# Altium project FMC_Power_Module.PrjPcb
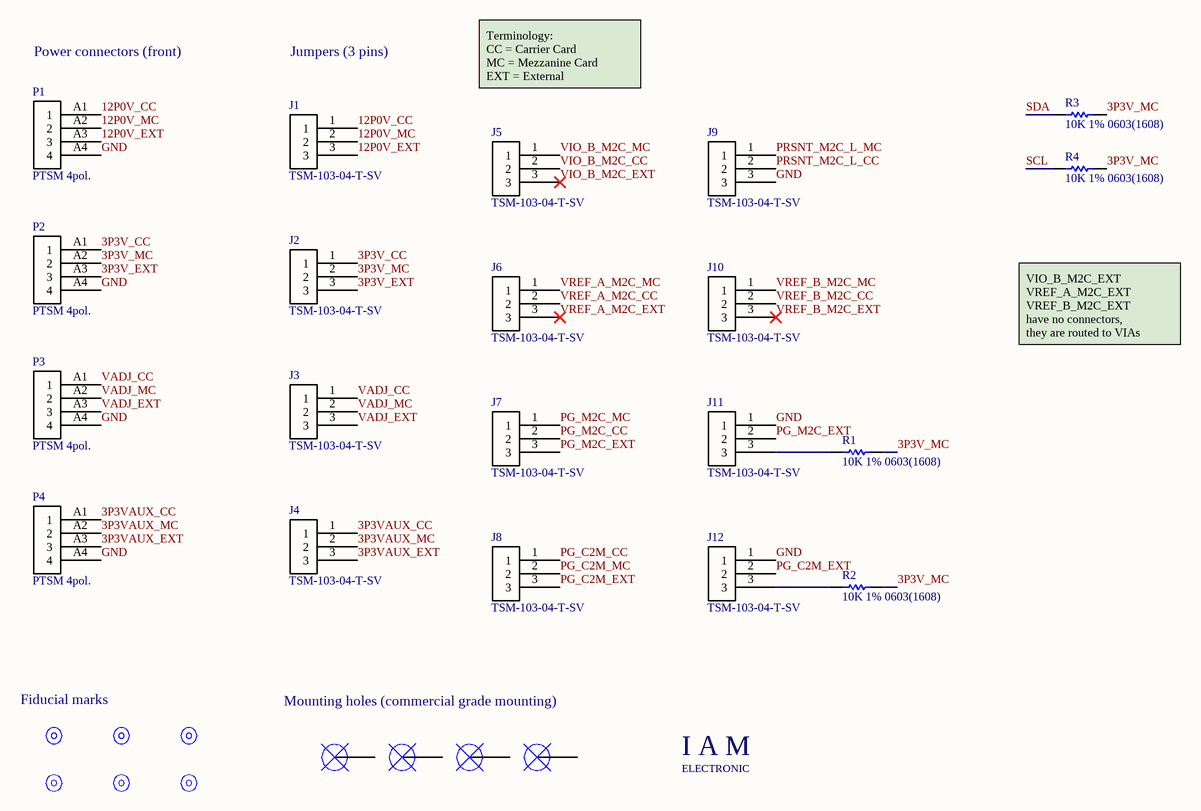
[diagram p0: FMC_Power_Module.SchDoc]
6 sheets, 33 parts. Net scope: global (net labels, ports and power ports of the same name join across sheets).
Board file: FMC_Power_Module.PcbDoc
Sheets:
  FMC_Power_Module.SchDoc
  HPC_AB.SchDoc
  HPC_CD.SchDoc
  HPC_EF.SchDoc
  HPC_GH.SchDoc
  HPC_IJ.SchDoc

## Sheet FMC_Power_Module.SchDoc: Front panel connectors, Jumpers, Mounting holes, and Fiducials
size A4; Date: 20.05.2022; ApprovedBy: PFH; CompanyName: IAM Electronic GmbH; DrawnBy: PFH; Engineer: PFH; Revision: A; SheetNumber: 1; SheetTotal: 6; Projekt: FMC Power Module; Website: www.fmchub.com

### Parts
FM1  1mm  [FIDUCIAL_MARK_ROUND_RING]  (value not drawn)  (no BOM)
FM2  1mm  [FIDUCIAL_MARK_ROUND_RING]  (value not drawn)  (no BOM)
FM3  1mm  [FIDUCIAL_MARK_ROUND_RING]  (value not drawn)  (no BOM)
FM4  1mm  [FIDUCIAL_MARK_ROUND_RING]  (value not drawn)  (no BOM)
FM5  1mm  [FIDUCIAL_MARK_ROUND_RING]  (value not drawn)  (no BOM)
FM6  1mm  [FIDUCIAL_MARK_ROUND_RING]  (value not drawn)  (no BOM)
J1  TSM-103-04-T-SV  [TSM-103-04-T-SV]
J2  TSM-103-04-T-SV  [TSM-103-04-T-SV]
J3  TSM-103-04-T-SV  [TSM-103-04-T-SV]
J4  TSM-103-04-T-SV  [TSM-103-04-T-SV]
J5  TSM-103-04-T-SV  [TSM-103-04-T-SV]
J6  TSM-103-04-T-SV  [TSM-103-04-T-SV]
J7  TSM-103-04-T-SV  [TSM-103-04-T-SV]
J8  TSM-103-04-T-SV  [TSM-103-04-T-SV]
J9  TSM-103-04-T-SV  [TSM-103-04-T-SV]
J10  TSM-103-04-T-SV  [TSM-103-04-T-SV]
J11  TSM-103-04-T-SV  [TSM-103-04-T-SV]
J12  TSM-103-04-T-SV  [TSM-103-04-T-SV]
MH1  2.2mm  [Mounting_Hole_2.2mm]  (value not drawn)  (no BOM)
MH2  2.2mm  [Mounting_Hole_2.2mm]  (value not drawn)  (no BOM)
MH3  2.7mm  [Mounting_Hole_Plated_2.7mm-COVERED]  (value not drawn)  (no BOM)
MH4  2.7mm  [Mounting_Hole_Plated_2.7mm-COVERED]  (value not drawn)  (no BOM)
P1  PTSM 4pol.  [PTSM-4pol]
P2  PTSM 4pol.  [PTSM-4pol]
P3  PTSM 4pol.  [PTSM-4pol]
P4  PTSM 4pol.  [PTSM-4pol]
R1  10K 1% 0603(1608)  [RESC0603(1608)_N]
R2  10K 1% 0603(1608)  [RESC0603(1608)_N]
R3  10K 1% 0603(1608)  [RESC0603(1608)_N]
R4  10K 1% 0603(1608)  [RESC0603(1608)_N]
STR1  IAM LOGO  [IAM LOGO - LARGE - WWW]  (value not drawn)  (no BOM)

### Nets
3P3V_CC: J2.1 P2.A1(1)
3P3V_EXT: J2.3 P2.A3(3)
3P3V_MC: J2.2 P2.A2(2) R1.2 R2.2 R3.2 R4.2
3P3VAUX_CC: J4.1 P4.A1(1)
3P3VAUX_EXT: J4.3 P4.A3(3)
3P3VAUX_MC: J4.2 P4.A2(2)
12P0V_CC: J1.1 P1.A1(1)
12P0V_EXT: J1.3 P1.A3(3)
12P0V_MC: J1.2 P1.A2(2)
GND: J9.3 J11.1 J12.1 P1.A4(4) P2.A4(4) P3.A4(4) P4.A4(4)
PG_C2M_CC: J8.1
PG_C2M_EXT: J8.3 J12.2
PG_C2M_MC: J8.2
PG_M2C_CC: J7.2
PG_M2C_EXT: J7.3 J11.2
PG_M2C_MC: J7.1
PRSNT_M2C_L_CC: J9.2
PRSNT_M2C_L_MC: J9.1
SCL: R4.1
SDA: R3.1
VADJ_CC: J3.1 P3.A1(1)
VADJ_EXT: J3.3 P3.A3(3)
VADJ_MC: J3.2 P3.A2(2)
VIO_B_M2C_CC: J5.2
VIO_B_M2C_EXT: J5.3
VIO_B_M2C_MC: J5.1
VREF_A_M2C_CC: J6.2
VREF_A_M2C_EXT: J6.3
VREF_A_M2C_MC: J6.1
VREF_B_M2C_CC: J10.2
VREF_B_M2C_EXT: J10.3
VREF_B_M2C_MC: J10.1
NetJ11_3: J11.3 R1.1
NetJ12_3: J12.3 R2.1

Not connected (* = marked no-connect by the designer): FM1 FD0; FM2 FD0; FM3 FD0; FM4 FD0; FM5 FD0; FM6 FD0; MH1 0; MH2 0; MH3 0; MH4 0

### Notes on the sheet
- Power connectors (front)
- Jumpers (3 pins)
- Terminology:
  CC = Carrier Card
  MC = Mezzanine Card
  EXT = External
- VIO_B_M2C_EXT
  VREF_A_M2C_EXT
  VREF_B_M2C_EXT
  have no connectors,
  they are routed to VIAs
- Fiducial marks
- Mounting holes (commercial grade mounting)
- Title:
- Project:
- Date:
- Website:
- Rev:
- Engineer:
- Sheet:
- /
- (in symbol IAM_LOGO) I A M; ELECTRONIC

### Library data of the parts
FM1-FM6 = Fiducial_Mark: Fiducial mark, width 1mm, clearance 3mm; Width: 1 mm; Clearance: 3 mm
J1-J12 = TSM-103-04-T-SV: .100" (2.54 mm) pitch 3 pin header, 0.27" (6.86 mm) total height, SMT; Manufacturer: Samtec; Part: TSM-103-04-T-SV
MH1 MH2 = Mounting_Hole_2.2mm: Mounting hole, hole size 2.2mm; Hole radius: 2.2 mm; Diameter (plated): *; Keep out (radius): *; Plated: *
MH3 MH4 = Mounting_Hole_2.7mm: Mounting hole, hole size 2.7mm; Hole radius: 2.7 mm; Diameter (plated): *; Keep out (radius): *; Plated: *
P1-P4 = PC-PTSM-4pol: Phoenix Contact PTSM SMT connector; Part: 1814650; Manufacturer: Phoenix Contact
R1-R4 = CMP-1012-00623-1: 10K 0603 (1608 Metric)  SMD; Part: WR06X1002FTL; Manufacturer: Walsin; Power: 0.1 W; Value: 10000.00 Ohm; Case-EIA: 0603; Case-Metric: 1608; Tolerance: 1 %; Technology: SMT
STR1 = IAM_LOGO: I A M E L E C T R O N I C - Logo; Layer: Top Overlay; Manufacturer: IAM ELECTRONIC; Part: Logo

## Sheet HPC_AB.SchDoc: HPC connector ROW A and ROW B
size A4; Date: 20.05.2022; ApprovedBy: PFH; CompanyName: IAM Electronic GmbH; DrawnBy: PFH; Engineer: PFH; Revision: A; SheetNumber: 2; SheetTotal: 6; Projekt: FMC Power Module; Website: www.iamelectronic.com
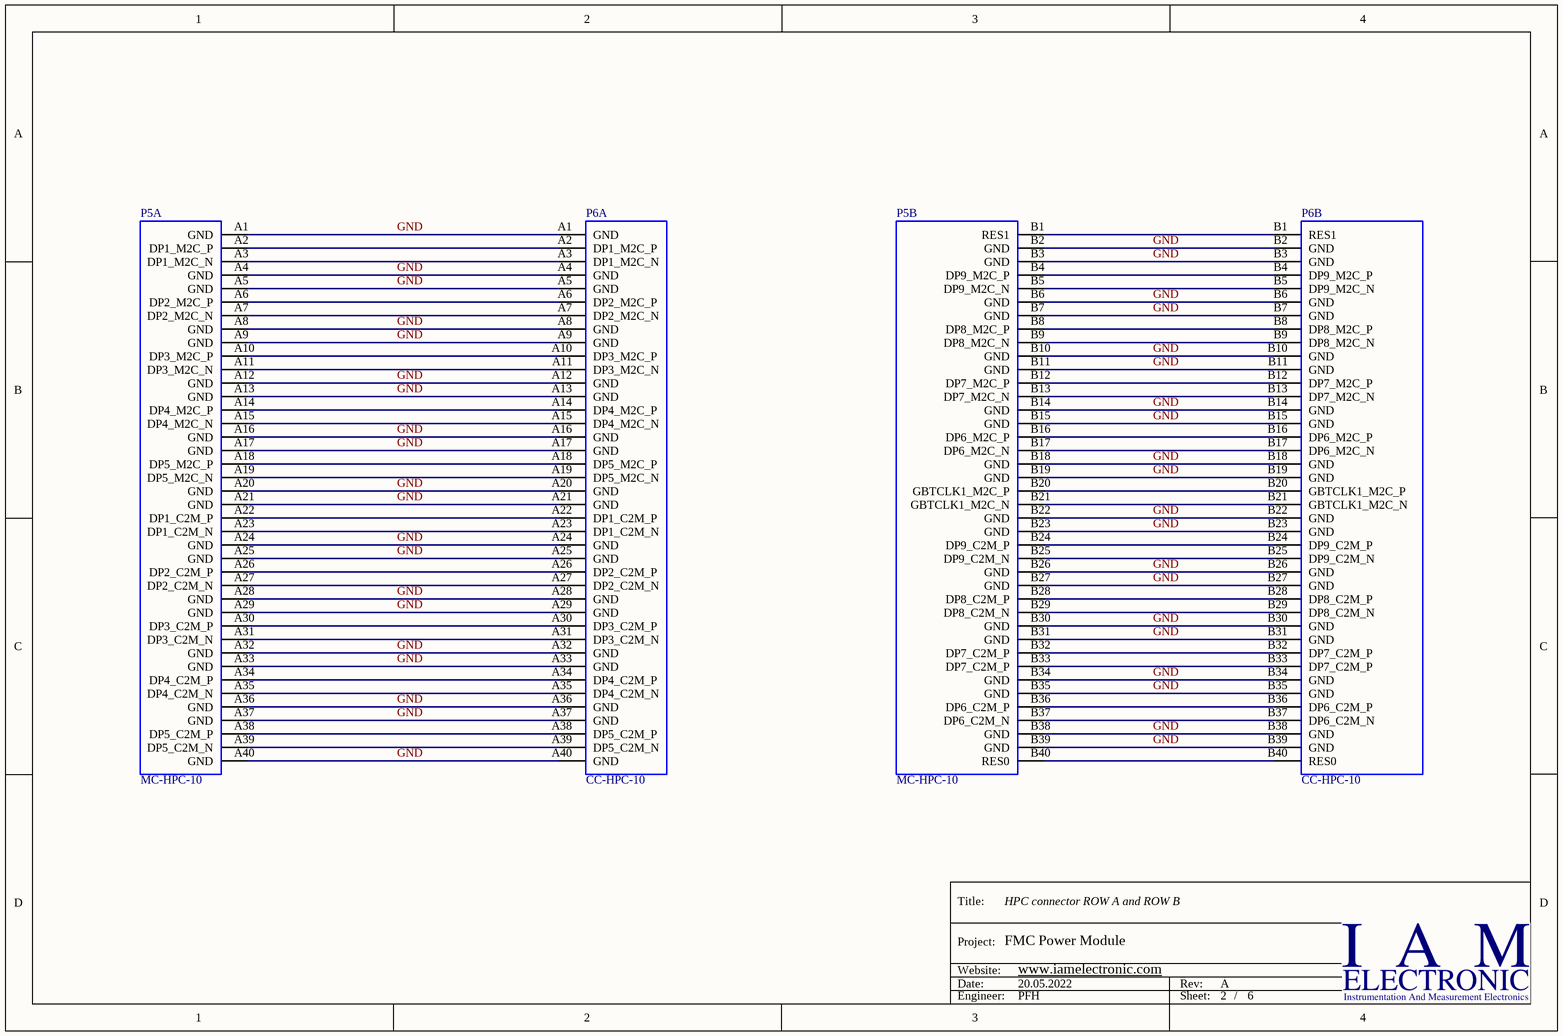
[diagram p1: HPC_AB.SchDoc]

### Parts
P5  MC-HPC-10  [ASP-134488-01]  (parts A,B of 10)
P6  CC-HPC-10  [ASP-134486-01]  (parts A,B of 10)

### Nets
GND: P5.A1(GND) P5.A4(GND) P5.A5(GND) P5.A8(GND) P5.A9(GND) P5.A12(GND) P5.A13(GND) P5.A16(GND) P5.A17(GND) P5.A20(GND) P5.A21(GND) P5.A24(GND) P5.A25(GND) P5.A28(GND) P5.A29(GND) P5.A32(GND) P5.A33(GND) P5.A36(GND) P5.A37(GND) P5.A40(GND) P5.B2(GND) P5.B3(GND) P5.B6(GND) P5.B7(GND) P5.B10(GND) P5.B11(GND) P5.B14(GND) P5.B15(GND) P5.B18(GND) P5.B19(GND) P5.B22(GND) P5.B23(GND) P5.B26(GND) P5.B27(GND) P5.B30(GND) P5.B31(GND) P5.B34(GND) P5.B35(GND) P5.B38(GND) P5.B39(GND) P6.A1(GND) P6.A4(GND) P6.A5(GND) P6.A8(GND) P6.A9(GND) P6.A12(GND) P6.A13(GND) P6.A16(GND) P6.A17(GND) P6.A20(GND) P6.A21(GND) P6.A24(GND) P6.A25(GND) P6.A28(GND) P6.A29(GND) P6.A32(GND) P6.A33(GND) P6.A36(GND) P6.A37(GND) P6.A40(GND) P6.B2(GND) P6.B3(GND) P6.B6(GND) P6.B7(GND) P6.B10(GND) P6.B11(GND) P6.B14(GND) P6.B15(GND) P6.B18(GND) P6.B19(GND) P6.B22(GND) P6.B23(GND) P6.B26(GND) P6.B27(GND) P6.B30(GND) P6.B31(GND) P6.B34(GND) P6.B35(GND) P6.B38(GND) P6.B39(GND)
NetP5_A2: P5.A2(DP1_M2C_P) P6.A2(DP1_M2C_P)
NetP5_A3: P5.A3(DP1_M2C_N) P6.A3(DP1_M2C_N)
NetP5_A6: P5.A6(DP2_M2C_P) P6.A6(DP2_M2C_P)
NetP5_A7: P5.A7(DP2_M2C_N) P6.A7(DP2_M2C_N)
NetP5_A10: P5.A10(DP3_M2C_P) P6.A10(DP3_M2C_P)
NetP5_A11: P5.A11(DP3_M2C_N) P6.A11(DP3_M2C_N)
NetP5_A14: P5.A14(DP4_M2C_P) P6.A14(DP4_M2C_P)
NetP5_A15: P5.A15(DP4_M2C_N) P6.A15(DP4_M2C_N)
NetP5_A18: P5.A18(DP5_M2C_P) P6.A18(DP5_M2C_P)
NetP5_A19: P5.A19(DP5_M2C_N) P6.A19(DP5_M2C_N)
NetP5_A22: P5.A22(DP1_C2M_P) P6.A22(DP1_C2M_P)
NetP5_A23: P5.A23(DP1_C2M_N) P6.A23(DP1_C2M_N)
NetP5_A26: P5.A26(DP2_C2M_P) P6.A26(DP2_C2M_P)
NetP5_A27: P5.A27(DP2_C2M_N) P6.A27(DP2_C2M_N)
NetP5_A30: P5.A30(DP3_C2M_P) P6.A30(DP3_C2M_P)
NetP5_A31: P5.A31(DP3_C2M_N) P6.A31(DP3_C2M_N)
NetP5_A34: P5.A34(DP4_C2M_P) P6.A34(DP4_C2M_P)
NetP5_A35: P5.A35(DP4_C2M_N) P6.A35(DP4_C2M_N)
NetP5_A38: P5.A38(DP5_C2M_P) P6.A38(DP5_C2M_P)
NetP5_A39: P5.A39(DP5_C2M_N) P6.A39(DP5_C2M_N)
NetP5_B1: P5.B1(RES1) P6.B1(RES1)
NetP5_B4: P5.B4(DP9_M2C_P) P6.B4(DP9_M2C_P)
NetP5_B5: P5.B5(DP9_M2C_N) P6.B5(DP9_M2C_N)
NetP5_B8: P5.B8(DP8_M2C_P) P6.B8(DP8_M2C_P)
NetP5_B9: P5.B9(DP8_M2C_N) P6.B9(DP8_M2C_N)
NetP5_B12: P5.B12(DP7_M2C_P) P6.B12(DP7_M2C_P)
NetP5_B13: P5.B13(DP7_M2C_N) P6.B13(DP7_M2C_N)
NetP5_B16: P5.B16(DP6_M2C_P) P6.B16(DP6_M2C_P)
NetP5_B17: P5.B17(DP6_M2C_N) P6.B17(DP6_M2C_N)
NetP5_B20: P5.B20(GBTCLK1_M2C_P) P6.B20(GBTCLK1_M2C_P)
NetP5_B21: P5.B21(GBTCLK1_M2C_N) P6.B21(GBTCLK1_M2C_N)
NetP5_B24: P5.B24(DP9_C2M_P) P6.B24(DP9_C2M_P)
NetP5_B25: P5.B25(DP9_C2M_N) P6.B25(DP9_C2M_N)
NetP5_B28: P5.B28(DP8_C2M_P) P6.B28(DP8_C2M_P)
NetP5_B29: P5.B29(DP8_C2M_N) P6.B29(DP8_C2M_N)
NetP5_B32: P5.B32(DP7_C2M_P) P6.B32(DP7_C2M_P)
NetP5_B33: P5.B33(DP7_C2M_P) P6.B33(DP7_C2M_P)
NetP5_B36: P5.B36(DP6_C2M_P) P6.B36(DP6_C2M_P)
NetP5_B37: P5.B37(DP6_C2M_N) P6.B37(DP6_C2M_N)
NetP5_B40: P5.B40(RES0) P6.B40(RES0)

### Notes on the sheet
- Title:
- Project:
- Date:
- Website:
- Rev:
- Engineer:
- Sheet:
- /

### Library data of the parts
P5 = MC-HPC-10: MC-HPC-10, FMC High-pin count connector, lead free, 400 I/Os, male, 10 mm mated stack height; Manufacturer: Samtec; Manufacturer Ref: SEAM-40-03.5-S-10-2-A-K-TR-VITA57.0; Pitch: 1.27 mm; Mated Stack Height: 10 mm; Solder Type: Lead-Free; Number I/O: 400; PartName: ASP-134488-01; Part: ASP-134488-01; Vita PartNumber: MC-HPC-10; Pin Count: High; Gender: male; Supplier 1: Digi-Key; Supplier Part Number 1: SAM8730-ND
P6 = CC-HPC-10: CC-HPC-10, FMC High-pin count connector, lead free, 400 I/Os, female, 10 mm mated stack height; Manufacturer: Samtec; Manufacturer Ref: SEAF-40-06.5-10-A; Pitch: 1.27 mm; Mated Stack Height: 10 mm; Solder Type: Lead-Free; Number I/O: 400; PartName: ASP-134486-01; Part: ASP-134486-01; Vita PartNumber: CC-HPC-10; Pin Count: High; Gender: female; Supplier 1: Digi-Key; Supplier Part Number 1: SAM8728-ND

## Sheet HPC_CD.SchDoc: HPC connector ROW C and ROW D
size A4; Date: 20.05.2022; ApprovedBy: PFH; CompanyName: IAM Electronic GmbH; DrawnBy: PFH; Engineer: PFH; Revision: A; SheetNumber: 3; SheetTotal: 6; Projekt: FMC Power Module; Website: www.iamelectronic.com
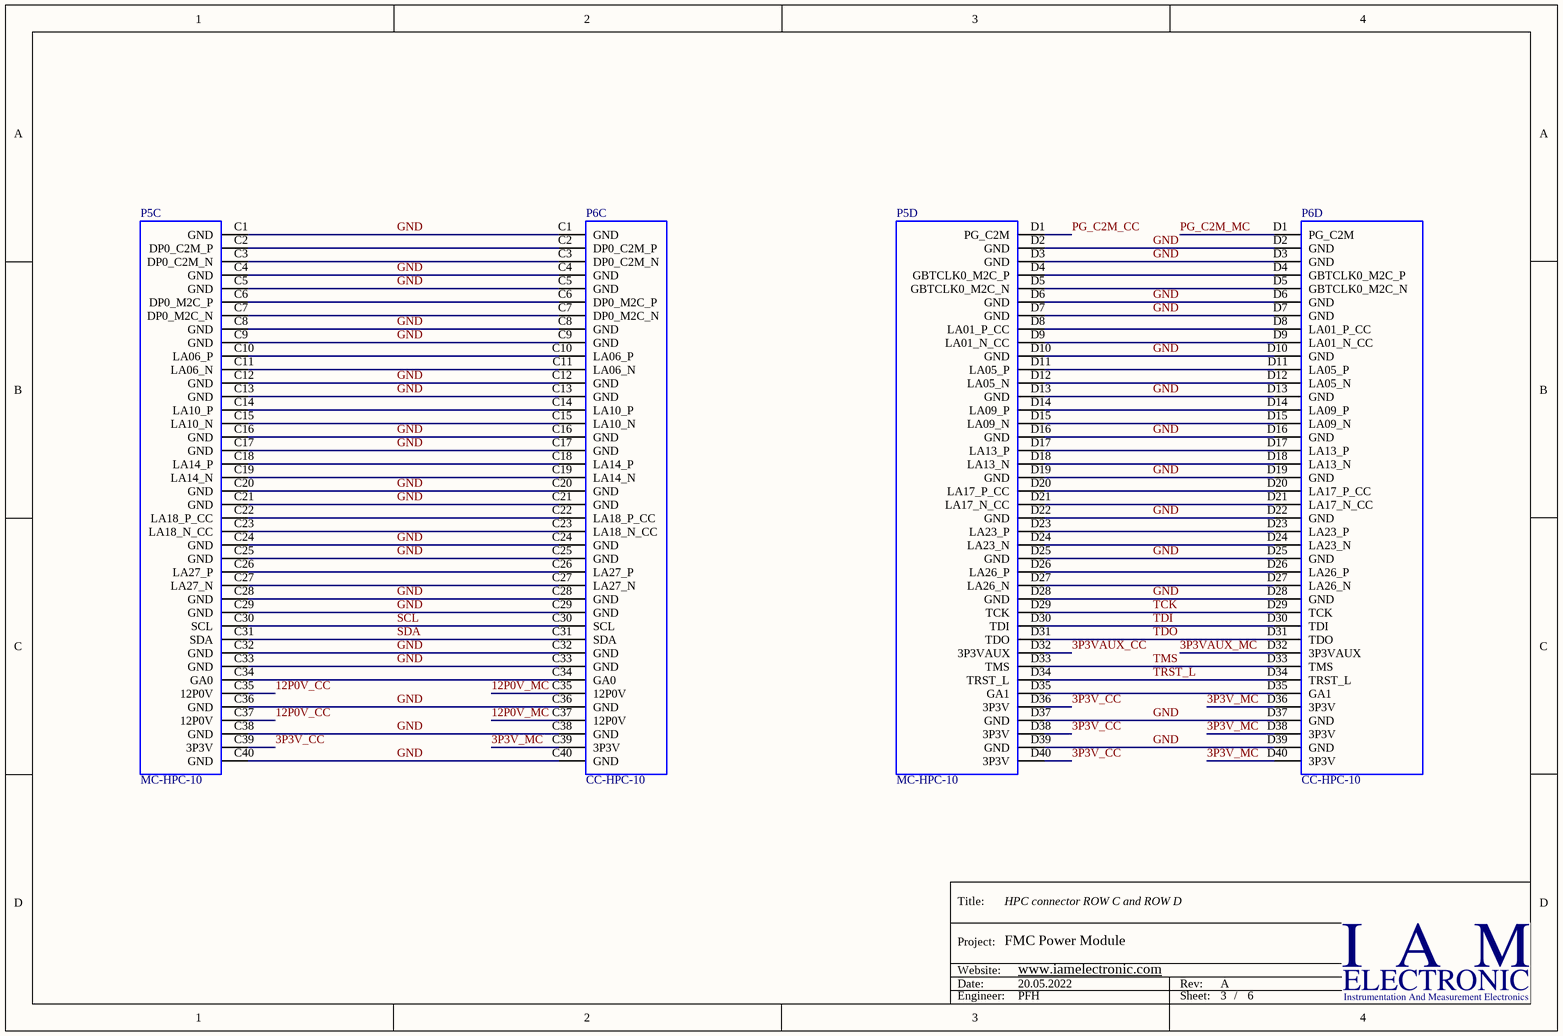
[diagram p2: HPC_CD.SchDoc]

### Parts
P5  MC-HPC-10  [ASP-134488-01]  (parts C,D of 10)
P6  CC-HPC-10  [ASP-134486-01]  (parts C,D of 10)

### Nets
3P3V_CC: P5.C39(3P3V) P5.D36(3P3V) P5.D38(3P3V) P5.D40(3P3V)
3P3V_MC: P6.C39(3P3V) P6.D36(3P3V) P6.D38(3P3V) P6.D40(3P3V)
3P3VAUX_CC: P5.D32(3P3VAUX)
3P3VAUX_MC: P6.D32(3P3VAUX)
12P0V_CC: P5.C35(12P0V) P5.C37(12P0V)
12P0V_MC: P6.C35(12P0V) P6.C37(12P0V)
GND: P5.C1(GND) P5.C4(GND) P5.C5(GND) P5.C8(GND) P5.C9(GND) P5.C12(GND) P5.C13(GND) P5.C16(GND) P5.C17(GND) P5.C20(GND) P5.C21(GND) P5.C24(GND) P5.C25(GND) P5.C28(GND) P5.C29(GND) P5.C32(GND) P5.C33(GND) P5.C36(GND) P5.C38(GND) P5.C40(GND) P5.D2(GND) P5.D3(GND) P5.D6(GND) P5.D7(GND) P5.D10(GND) P5.D13(GND) P5.D16(GND) P5.D19(GND) P5.D22(GND) P5.D25(GND) P5.D28(GND) P5.D37(GND) P5.D39(GND) P6.C1(GND) P6.C4(GND) P6.C5(GND) P6.C8(GND) P6.C9(GND) P6.C12(GND) P6.C13(GND) P6.C16(GND) P6.C17(GND) P6.C20(GND) P6.C21(GND) P6.C24(GND) P6.C25(GND) P6.C28(GND) P6.C29(GND) P6.C32(GND) P6.C33(GND) P6.C36(GND) P6.C38(GND) P6.C40(GND) P6.D2(GND) P6.D3(GND) P6.D6(GND) P6.D7(GND) P6.D10(GND) P6.D13(GND) P6.D16(GND) P6.D19(GND) P6.D22(GND) P6.D25(GND) P6.D28(GND) P6.D37(GND) P6.D39(GND)
PG_C2M_CC: P5.D1(PG_C2M)
PG_C2M_MC: P6.D1(PG_C2M)
SCL: P5.C30(SCL) P6.C30(SCL)
SDA: P5.C31(SDA) P6.C31(SDA)
TCK: P5.D29(TCK) P6.D29(TCK)
TDI: P5.D30(TDI) P6.D30(TDI)
TDO: P5.D31(TDO) P6.D31(TDO)
TMS: P5.D33(TMS) P6.D33(TMS)
TRST_L: P5.D34(TRST_L) P6.D34(TRST_L)
NetP5_C2: P5.C2(DP0_C2M_P) P6.C2(DP0_C2M_P)
NetP5_C3: P5.C3(DP0_C2M_N) P6.C3(DP0_C2M_N)
NetP5_C6: P5.C6(DP0_M2C_P) P6.C6(DP0_M2C_P)
NetP5_C7: P5.C7(DP0_M2C_N) P6.C7(DP0_M2C_N)
NetP5_C10: P5.C10(LA06_P) P6.C10(LA06_P)
NetP5_C11: P5.C11(LA06_N) P6.C11(LA06_N)
NetP5_C14: P5.C14(LA10_P) P6.C14(LA10_P)
NetP5_C15: P5.C15(LA10_N) P6.C15(LA10_N)
NetP5_C18: P5.C18(LA14_P) P6.C18(LA14_P)
NetP5_C19: P5.C19(LA14_N) P6.C19(LA14_N)
NetP5_C22: P5.C22(LA18_P_CC) P6.C22(LA18_P_CC)
NetP5_C23: P5.C23(LA18_N_CC) P6.C23(LA18_N_CC)
NetP5_C26: P5.C26(LA27_P) P6.C26(LA27_P)
NetP5_C27: P5.C27(LA27_N) P6.C27(LA27_N)
NetP5_C34: P5.C34(GA0) P6.C34(GA0)
NetP5_D4: P5.D4(GBTCLK0_M2C_P) P6.D4(GBTCLK0_M2C_P)
NetP5_D5: P5.D5(GBTCLK0_M2C_N) P6.D5(GBTCLK0_M2C_N)
NetP5_D8: P5.D8(LA01_P_CC) P6.D8(LA01_P_CC)
NetP5_D9: P5.D9(LA01_N_CC) P6.D9(LA01_N_CC)
NetP5_D11: P5.D11(LA05_P) P6.D11(LA05_P)
NetP5_D12: P5.D12(LA05_N) P6.D12(LA05_N)
NetP5_D14: P5.D14(LA09_P) P6.D14(LA09_P)
NetP5_D15: P5.D15(LA09_N) P6.D15(LA09_N)
NetP5_D17: P5.D17(LA13_P) P6.D17(LA13_P)
NetP5_D18: P5.D18(LA13_N) P6.D18(LA13_N)
NetP5_D20: P5.D20(LA17_P_CC) P6.D20(LA17_P_CC)
NetP5_D21: P5.D21(LA17_N_CC) P6.D21(LA17_N_CC)
NetP5_D23: P5.D23(LA23_P) P6.D23(LA23_P)
NetP5_D24: P5.D24(LA23_N) P6.D24(LA23_N)
NetP5_D26: P5.D26(LA26_P) P6.D26(LA26_P)
NetP5_D27: P5.D27(LA26_N) P6.D27(LA26_N)
NetP5_D35: P5.D35(GA1) P6.D35(GA1)

### Notes on the sheet
- Title:
- Project:
- Date:
- Website:
- Rev:
- Engineer:
- Sheet:
- /

### Library data of the parts
P5 = MC-HPC-10: as P5 on sheet HPC_AB; PartName: ASP-134488-01; Part: ASP-134488-01; Vita PartNumber: MC-HPC-10; Pin Count: High; Gender: male; Supplier 1: Digi-Key; Supplier Part Number 1: SAM8730-ND
P6 = CC-HPC-10: as P6 on sheet HPC_AB; PartName: ASP-134486-01; Part: ASP-134486-01; Vita PartNumber: CC-HPC-10; Pin Count: High; Gender: female; Supplier 1: Digi-Key; Supplier Part Number 1: SAM8728-ND

## Sheet HPC_EF.SchDoc: HPC connector ROW E and ROW F
size A4; Date: 20.05.2022; ApprovedBy: PFH; CompanyName: IAM Electronic GmbH; DrawnBy: PFH; Engineer: PFH; Revision: A; SheetNumber: 4; SheetTotal: 6; Projekt: FMC Power Module; Website: www.iamelectronic.com
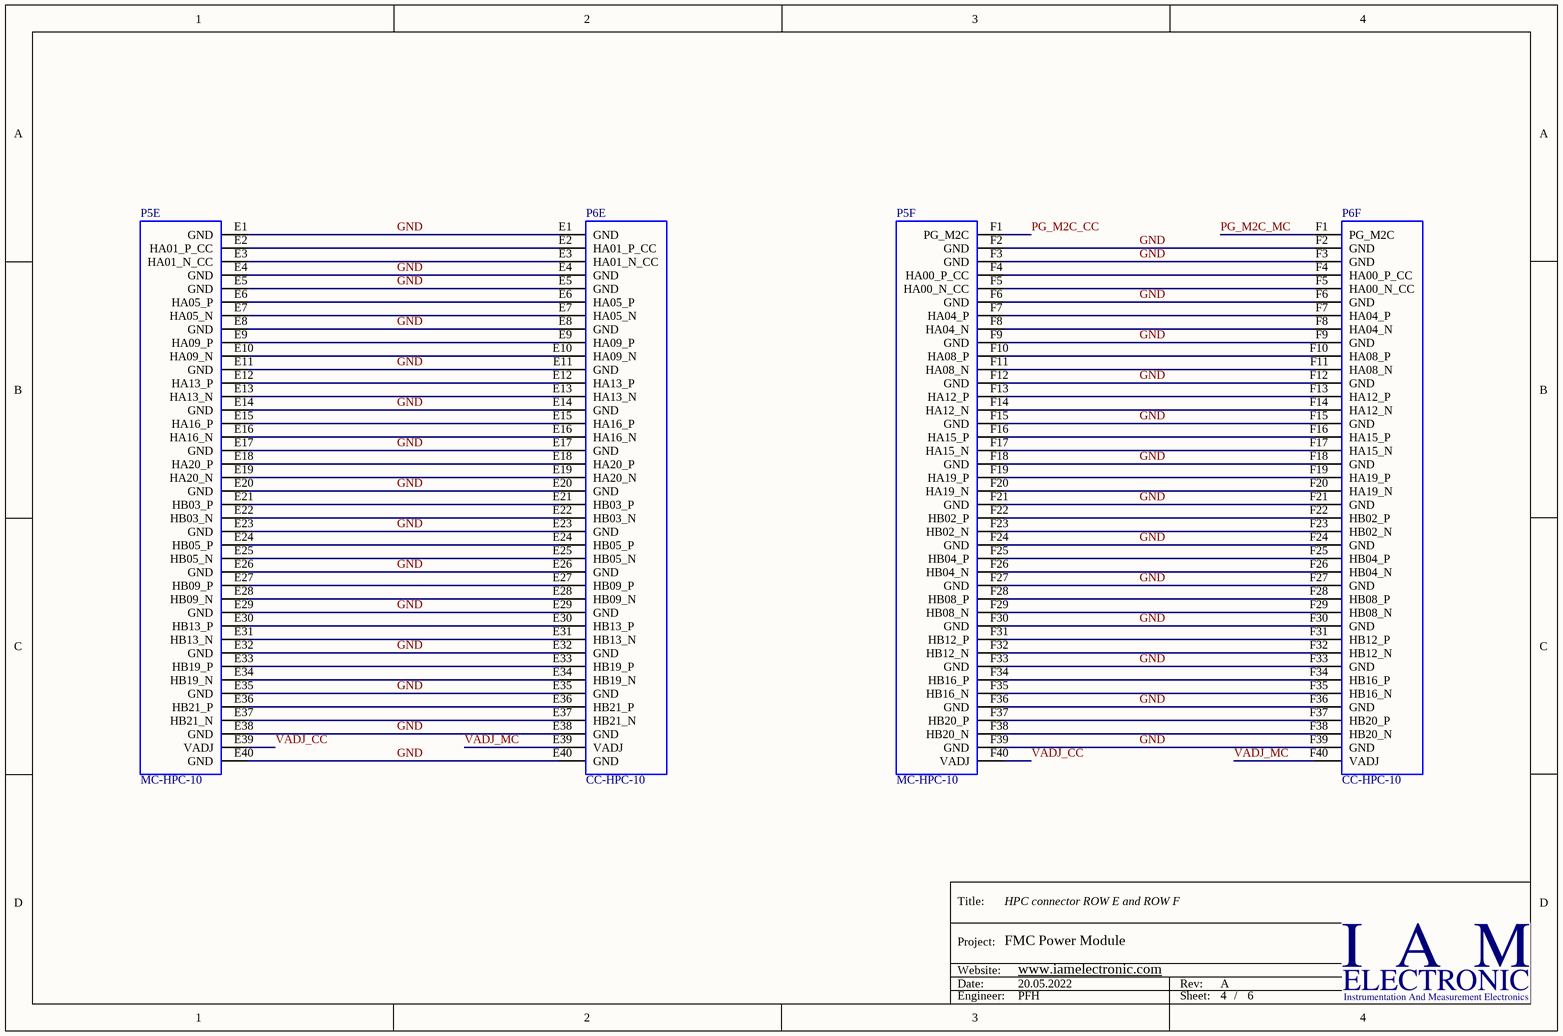
[diagram p3: HPC_EF.SchDoc]

### Parts
P5  MC-HPC-10  [ASP-134488-01]  (parts E,F of 10)
P6  CC-HPC-10  [ASP-134486-01]  (parts E,F of 10)

### Nets
GND: P5.E1(GND) P5.E4(GND) P5.E5(GND) P5.E8(GND) P5.E11(GND) P5.E14(GND) P5.E17(GND) P5.E20(GND) P5.E23(GND) P5.E26(GND) P5.E29(GND) P5.E32(GND) P5.E35(GND) P5.E38(GND) P5.E40(GND) P5.F2(GND) P5.F3(GND) P5.F6(GND) P5.F9(GND) P5.F12(GND) P5.F15(GND) P5.F18(GND) P5.F21(GND) P5.F24(GND) P5.F27(GND) P5.F30(GND) P5.F33(GND) P5.F36(GND) P5.F39(GND) P6.E1(GND) P6.E4(GND) P6.E5(GND) P6.E8(GND) P6.E11(GND) P6.E14(GND) P6.E17(GND) P6.E20(GND) P6.E23(GND) P6.E26(GND) P6.E29(GND) P6.E32(GND) P6.E35(GND) P6.E38(GND) P6.E40(GND) P6.F2(GND) P6.F3(GND) P6.F6(GND) P6.F9(GND) P6.F12(GND) P6.F15(GND) P6.F18(GND) P6.F21(GND) P6.F24(GND) P6.F27(GND) P6.F30(GND) P6.F33(GND) P6.F36(GND) P6.F39(GND)
PG_M2C_CC: P5.F1(PG_M2C)
PG_M2C_MC: P6.F1(PG_M2C)
VADJ_CC: P5.E39(VADJ) P5.F40(VADJ)
VADJ_MC: P6.E39(VADJ) P6.F40(VADJ)
NetP5_E2: P5.E2(HA01_P_CC) P6.E2(HA01_P_CC)
NetP5_E3: P5.E3(HA01_N_CC) P6.E3(HA01_N_CC)
NetP5_E6: P5.E6(HA05_P) P6.E6(HA05_P)
NetP5_E7: P5.E7(HA05_N) P6.E7(HA05_N)
NetP5_E9: P5.E9(HA09_P) P6.E9(HA09_P)
NetP5_E10: P5.E10(HA09_N) P6.E10(HA09_N)
NetP5_E12: P5.E12(HA13_P) P6.E12(HA13_P)
NetP5_E13: P5.E13(HA13_N) P6.E13(HA13_N)
NetP5_E15: P5.E15(HA16_P) P6.E15(HA16_P)
NetP5_E16: P5.E16(HA16_N) P6.E16(HA16_N)
NetP5_E18: P5.E18(HA20_P) P6.E18(HA20_P)
NetP5_E19: P5.E19(HA20_N) P6.E19(HA20_N)
NetP5_E21: P5.E21(HB03_P) P6.E21(HB03_P)
NetP5_E22: P5.E22(HB03_N) P6.E22(HB03_N)
NetP5_E24: P5.E24(HB05_P) P6.E24(HB05_P)
NetP5_E25: P5.E25(HB05_N) P6.E25(HB05_N)
NetP5_E27: P5.E27(HB09_P) P6.E27(HB09_P)
NetP5_E28: P5.E28(HB09_N) P6.E28(HB09_N)
NetP5_E30: P5.E30(HB13_P) P6.E30(HB13_P)
NetP5_E31: P5.E31(HB13_N) P6.E31(HB13_N)
NetP5_E33: P5.E33(HB19_P) P6.E33(HB19_P)
NetP5_E34: P5.E34(HB19_N) P6.E34(HB19_N)
NetP5_E36: P5.E36(HB21_P) P6.E36(HB21_P)
NetP5_E37: P5.E37(HB21_N) P6.E37(HB21_N)
NetP5_F4: P5.F4(HA00_P_CC) P6.F4(HA00_P_CC)
NetP5_F5: P5.F5(HA00_N_CC) P6.F5(HA00_N_CC)
NetP5_F7: P5.F7(HA04_P) P6.F7(HA04_P)
NetP5_F8: P5.F8(HA04_N) P6.F8(HA04_N)
NetP5_F10: P5.F10(HA08_P) P6.F10(HA08_P)
NetP5_F11: P5.F11(HA08_N) P6.F11(HA08_N)
NetP5_F13: P5.F13(HA12_P) P6.F13(HA12_P)
NetP5_F14: P5.F14(HA12_N) P6.F14(HA12_N)
NetP5_F16: P5.F16(HA15_P) P6.F16(HA15_P)
NetP5_F17: P5.F17(HA15_N) P6.F17(HA15_N)
NetP5_F19: P5.F19(HA19_P) P6.F19(HA19_P)
NetP5_F20: P5.F20(HA19_N) P6.F20(HA19_N)
NetP5_F22: P5.F22(HB02_P) P6.F22(HB02_P)
NetP5_F23: P5.F23(HB02_N) P6.F23(HB02_N)
NetP5_F25: P5.F25(HB04_P) P6.F25(HB04_P)
NetP5_F26: P5.F26(HB04_N) P6.F26(HB04_N)
NetP5_F28: P5.F28(HB08_P) P6.F28(HB08_P)
NetP5_F29: P5.F29(HB08_N) P6.F29(HB08_N)
NetP5_F31: P5.F31(HB12_P) P6.F31(HB12_P)
NetP5_F32: P5.F32(HB12_N) P6.F32(HB12_N)
NetP5_F34: P5.F34(HB16_P) P6.F34(HB16_P)
NetP5_F35: P5.F35(HB16_N) P6.F35(HB16_N)
NetP5_F37: P5.F37(HB20_P) P6.F37(HB20_P)
NetP5_F38: P5.F38(HB20_N) P6.F38(HB20_N)

### Notes on the sheet
- Title:
- Project:
- Date:
- Website:
- Rev:
- Engineer:
- Sheet:
- /

### Library data of the parts
P5 = MC-HPC-10: as P5 on sheet HPC_AB; PartName: ASP-134488-01; Part: ASP-134488-01; Vita PartNumber: MC-HPC-10; Pin Count: High; Gender: male; Supplier 1: Digi-Key; Supplier Part Number 1: SAM8730-ND
P6 = CC-HPC-10: as P6 on sheet HPC_AB; PartName: ASP-134486-01; Part: ASP-134486-01; Vita PartNumber: CC-HPC-10; Pin Count: High; Gender: female; Supplier 1: Digi-Key; Supplier Part Number 1: SAM8728-ND

## Sheet HPC_GH.SchDoc: HPC connector ROW G and ROW H
size A4; Date: 20.05.2022; ApprovedBy: PFH; CompanyName: IAM Electronic GmbH; DrawnBy: PFH; Engineer: PFH; Revision: A; SheetNumber: 5; SheetTotal: 6; Projekt: FMC Power Module; Website: www.iamelectronic.com
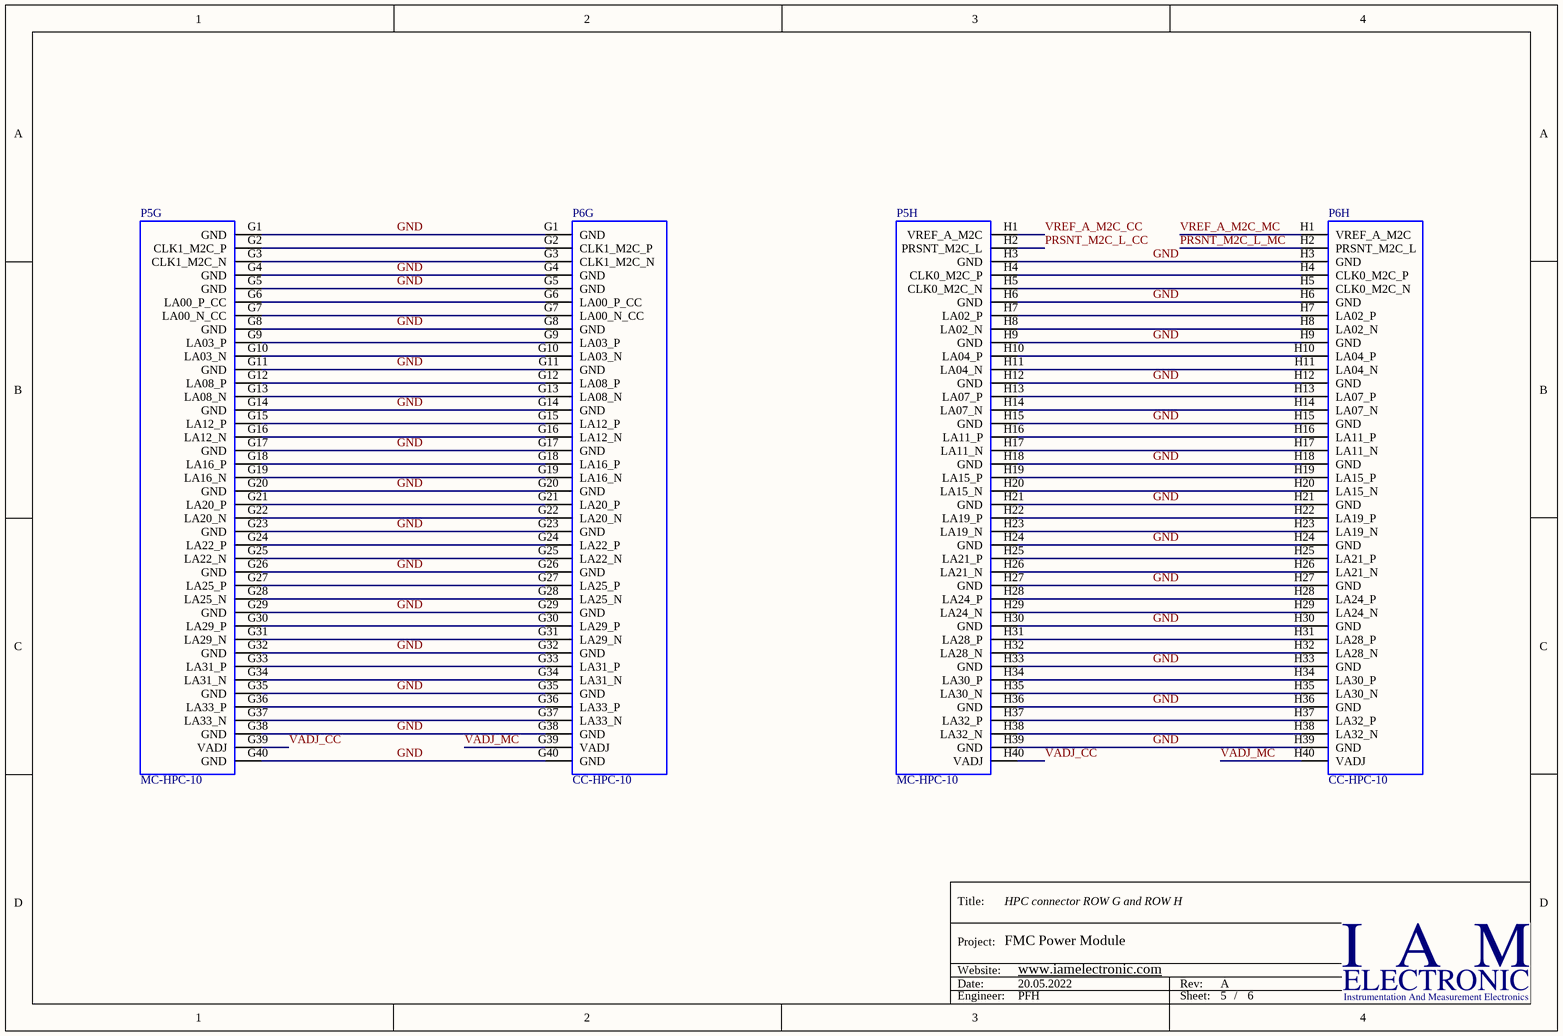
[diagram p4: HPC_GH.SchDoc]

### Parts
P5  MC-HPC-10  [ASP-134488-01]  (parts G,H of 10)
P6  CC-HPC-10  [ASP-134486-01]  (parts G,H of 10)

### Nets
GND: P5.G1(GND) P5.G4(GND) P5.G5(GND) P5.G8(GND) P5.G11(GND) P5.G14(GND) P5.G17(GND) P5.G20(GND) P5.G23(GND) P5.G26(GND) P5.G29(GND) P5.G32(GND) P5.G35(GND) P5.G38(GND) P5.G40(GND) P5.H3(GND) P5.H6(GND) P5.H9(GND) P5.H12(GND) P5.H15(GND) P5.H18(GND) P5.H21(GND) P5.H24(GND) P5.H27(GND) P5.H30(GND) P5.H33(GND) P5.H36(GND) P5.H39(GND) P6.G1(GND) P6.G4(GND) P6.G5(GND) P6.G8(GND) P6.G11(GND) P6.G14(GND) P6.G17(GND) P6.G20(GND) P6.G23(GND) P6.G26(GND) P6.G29(GND) P6.G32(GND) P6.G35(GND) P6.G38(GND) P6.G40(GND) P6.H3(GND) P6.H6(GND) P6.H9(GND) P6.H12(GND) P6.H15(GND) P6.H18(GND) P6.H21(GND) P6.H24(GND) P6.H27(GND) P6.H30(GND) P6.H33(GND) P6.H36(GND) P6.H39(GND)
PRSNT_M2C_L_CC: P5.H2(PRSNT_M2C_L)
PRSNT_M2C_L_MC: P6.H2(PRSNT_M2C_L)
VADJ_CC: P5.G39(VADJ) P5.H40(VADJ)
VADJ_MC: P6.G39(VADJ) P6.H40(VADJ)
VREF_A_M2C_CC: P5.H1(VREF_A_M2C)
VREF_A_M2C_MC: P6.H1(VREF_A_M2C)
NetP5_G2: P5.G2(CLK1_M2C_P) P6.G2(CLK1_M2C_P)
NetP5_G3: P5.G3(CLK1_M2C_N) P6.G3(CLK1_M2C_N)
NetP5_G6: P5.G6(LA00_P_CC) P6.G6(LA00_P_CC)
NetP5_G7: P5.G7(LA00_N_CC) P6.G7(LA00_N_CC)
NetP5_G9: P5.G9(LA03_P) P6.G9(LA03_P)
NetP5_G10: P5.G10(LA03_N) P6.G10(LA03_N)
NetP5_G12: P5.G12(LA08_P) P6.G12(LA08_P)
NetP5_G13: P5.G13(LA08_N) P6.G13(LA08_N)
NetP5_G15: P5.G15(LA12_P) P6.G15(LA12_P)
NetP5_G16: P5.G16(LA12_N) P6.G16(LA12_N)
NetP5_G18: P5.G18(LA16_P) P6.G18(LA16_P)
NetP5_G19: P5.G19(LA16_N) P6.G19(LA16_N)
NetP5_G21: P5.G21(LA20_P) P6.G21(LA20_P)
NetP5_G22: P5.G22(LA20_N) P6.G22(LA20_N)
NetP5_G24: P5.G24(LA22_P) P6.G24(LA22_P)
NetP5_G25: P5.G25(LA22_N) P6.G25(LA22_N)
NetP5_G27: P5.G27(LA25_P) P6.G27(LA25_P)
NetP5_G28: P5.G28(LA25_N) P6.G28(LA25_N)
NetP5_G30: P5.G30(LA29_P) P6.G30(LA29_P)
NetP5_G31: P5.G31(LA29_N) P6.G31(LA29_N)
NetP5_G33: P5.G33(LA31_P) P6.G33(LA31_P)
NetP5_G34: P5.G34(LA31_N) P6.G34(LA31_N)
NetP5_G36: P5.G36(LA33_P) P6.G36(LA33_P)
NetP5_G37: P5.G37(LA33_N) P6.G37(LA33_N)
NetP5_H4: P5.H4(CLK0_M2C_P) P6.H4(CLK0_M2C_P)
NetP5_H5: P5.H5(CLK0_M2C_N) P6.H5(CLK0_M2C_N)
NetP5_H7: P5.H7(LA02_P) P6.H7(LA02_P)
NetP5_H8: P5.H8(LA02_N) P6.H8(LA02_N)
NetP5_H10: P5.H10(LA04_P) P6.H10(LA04_P)
NetP5_H11: P5.H11(LA04_N) P6.H11(LA04_N)
NetP5_H13: P5.H13(LA07_P) P6.H13(LA07_P)
NetP5_H14: P5.H14(LA07_N) P6.H14(LA07_N)
NetP5_H16: P5.H16(LA11_P) P6.H16(LA11_P)
NetP5_H17: P5.H17(LA11_N) P6.H17(LA11_N)
NetP5_H19: P5.H19(LA15_P) P6.H19(LA15_P)
NetP5_H20: P5.H20(LA15_N) P6.H20(LA15_N)
NetP5_H22: P5.H22(LA19_P) P6.H22(LA19_P)
NetP5_H23: P5.H23(LA19_N) P6.H23(LA19_N)
NetP5_H25: P5.H25(LA21_P) P6.H25(LA21_P)
NetP5_H26: P5.H26(LA21_N) P6.H26(LA21_N)
NetP5_H28: P5.H28(LA24_P) P6.H28(LA24_P)
NetP5_H29: P5.H29(LA24_N) P6.H29(LA24_N)
NetP5_H31: P5.H31(LA28_P) P6.H31(LA28_P)
NetP5_H32: P5.H32(LA28_N) P6.H32(LA28_N)
NetP5_H34: P5.H34(LA30_P) P6.H34(LA30_P)
NetP5_H35: P5.H35(LA30_N) P6.H35(LA30_N)
NetP5_H37: P5.H37(LA32_P) P6.H37(LA32_P)
NetP5_H38: P5.H38(LA32_N) P6.H38(LA32_N)

### Notes on the sheet
- Title:
- Project:
- Date:
- Website:
- Rev:
- Engineer:
- Sheet:
- /

### Library data of the parts
P5 = MC-HPC-10: as P5 on sheet HPC_AB; PartName: ASP-134488-01; Part: ASP-134488-01; Vita PartNumber: MC-HPC-10; Pin Count: High; Gender: male; Supplier 1: Digi-Key; Supplier Part Number 1: SAM8730-ND
P6 = CC-HPC-10: as P6 on sheet HPC_AB; PartName: ASP-134486-01; Part: ASP-134486-01; Vita PartNumber: CC-HPC-10; Pin Count: High; Gender: female; Supplier 1: Digi-Key; Supplier Part Number 1: SAM8728-ND

## Sheet HPC_IJ.SchDoc: HPC connector ROW J and ROW K
size A4; Date: 20.05.2022; ApprovedBy: PFH; CompanyName: IAM Electronic GmbH; DrawnBy: PFH; Engineer: PFH; Revision: A; SheetNumber: 6; SheetTotal: 6; Projekt: FMC Power Module; Website: www.iamelectronic.com
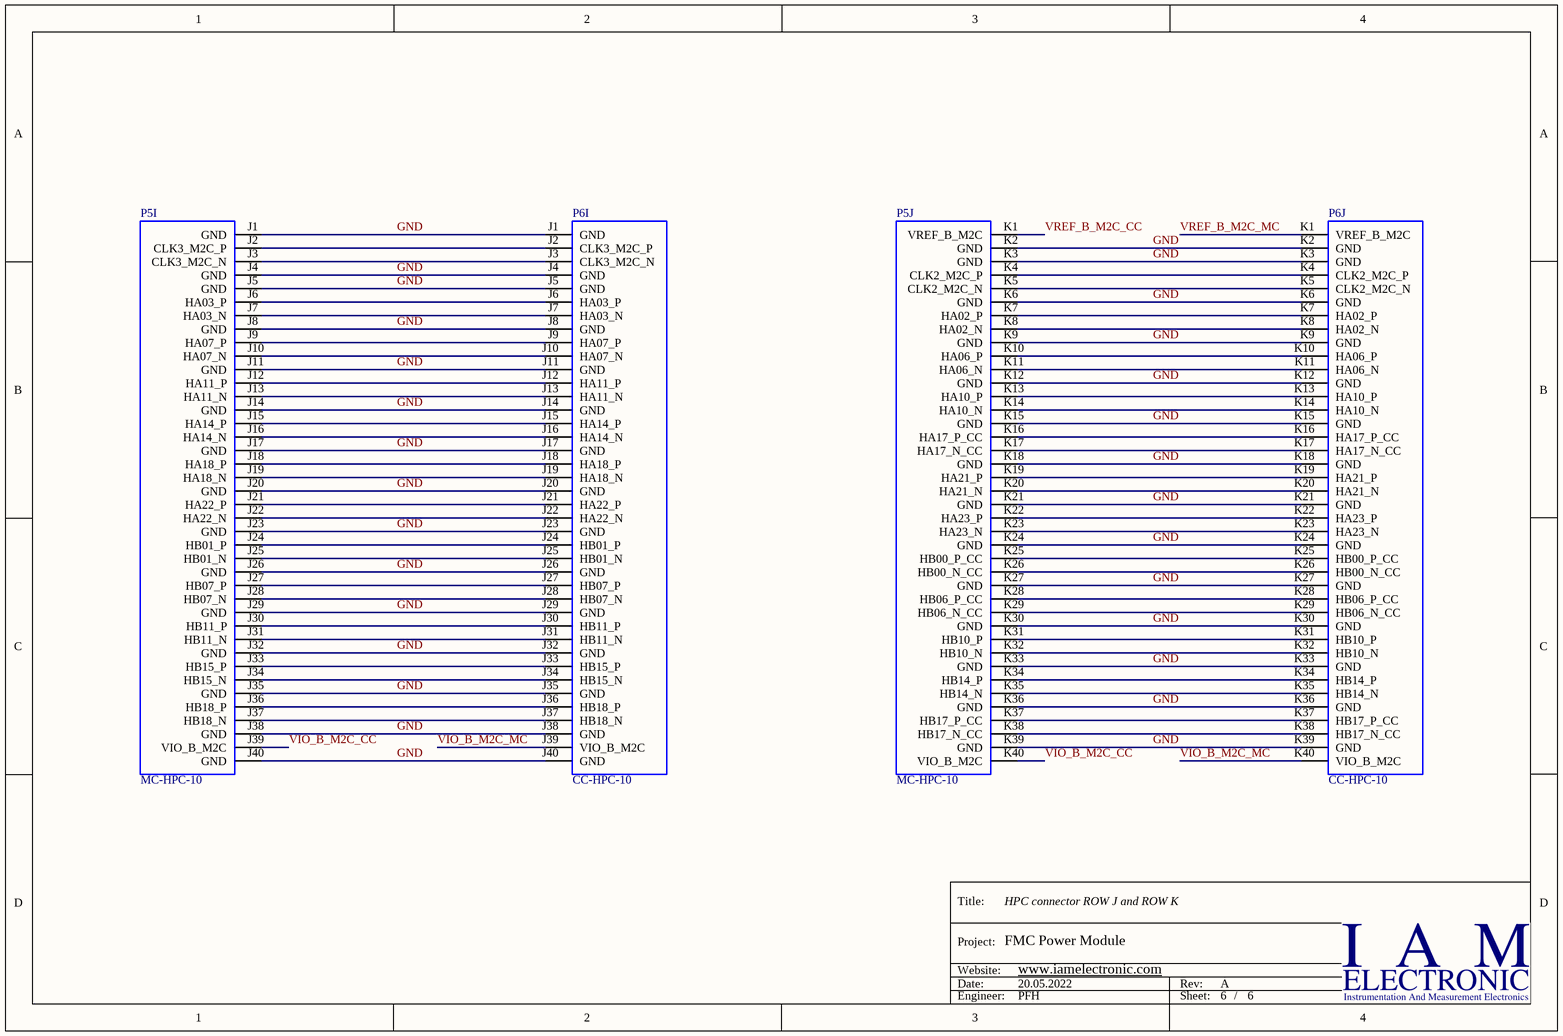
[diagram p5: HPC_IJ.SchDoc]

### Parts
P5  MC-HPC-10  [ASP-134488-01]  (parts I,J of 10)
P6  CC-HPC-10  [ASP-134486-01]  (parts I,J of 10)

### Nets
GND: P5.J1(GND) P5.J4(GND) P5.J5(GND) P5.J8(GND) P5.J11(GND) P5.J14(GND) P5.J17(GND) P5.J20(GND) P5.J23(GND) P5.J26(GND) P5.J29(GND) P5.J32(GND) P5.J35(GND) P5.J38(GND) P5.J40(GND) P5.K2(GND) P5.K3(GND) P5.K6(GND) P5.K9(GND) P5.K12(GND) P5.K15(GND) P5.K18(GND) P5.K21(GND) P5.K24(GND) P5.K27(GND) P5.K30(GND) P5.K33(GND) P5.K36(GND) P5.K39(GND) P6.J1(GND) P6.J4(GND) P6.J5(GND) P6.J8(GND) P6.J11(GND) P6.J14(GND) P6.J17(GND) P6.J20(GND) P6.J23(GND) P6.J26(GND) P6.J29(GND) P6.J32(GND) P6.J35(GND) P6.J38(GND) P6.J40(GND) P6.K2(GND) P6.K3(GND) P6.K6(GND) P6.K9(GND) P6.K12(GND) P6.K15(GND) P6.K18(GND) P6.K21(GND) P6.K24(GND) P6.K27(GND) P6.K30(GND) P6.K33(GND) P6.K36(GND) P6.K39(GND)
VIO_B_M2C_CC: P5.J39(VIO_B_M2C) P5.K40(VIO_B_M2C)
VIO_B_M2C_MC: P6.J39(VIO_B_M2C) P6.K40(VIO_B_M2C)
VREF_B_M2C_CC: P5.K1(VREF_B_M2C)
VREF_B_M2C_MC: P6.K1(VREF_B_M2C)
NetP5_J2: P5.J2(CLK3_M2C_P) P6.J2(CLK3_M2C_P)
NetP5_J3: P5.J3(CLK3_M2C_N) P6.J3(CLK3_M2C_N)
NetP5_J6: P5.J6(HA03_P) P6.J6(HA03_P)
NetP5_J7: P5.J7(HA03_N) P6.J7(HA03_N)
NetP5_J9: P5.J9(HA07_P) P6.J9(HA07_P)
NetP5_J10: P5.J10(HA07_N) P6.J10(HA07_N)
NetP5_J12: P5.J12(HA11_P) P6.J12(HA11_P)
NetP5_J13: P5.J13(HA11_N) P6.J13(HA11_N)
NetP5_J15: P5.J15(HA14_P) P6.J15(HA14_P)
NetP5_J16: P5.J16(HA14_N) P6.J16(HA14_N)
NetP5_J18: P5.J18(HA18_P) P6.J18(HA18_P)
NetP5_J19: P5.J19(HA18_N) P6.J19(HA18_N)
NetP5_J21: P5.J21(HA22_P) P6.J21(HA22_P)
NetP5_J22: P5.J22(HA22_N) P6.J22(HA22_N)
NetP5_J24: P5.J24(HB01_P) P6.J24(HB01_P)
NetP5_J25: P5.J25(HB01_N) P6.J25(HB01_N)
NetP5_J27: P5.J27(HB07_P) P6.J27(HB07_P)
NetP5_J28: P5.J28(HB07_N) P6.J28(HB07_N)
NetP5_J30: P5.J30(HB11_P) P6.J30(HB11_P)
NetP5_J31: P5.J31(HB11_N) P6.J31(HB11_N)
NetP5_J33: P5.J33(HB15_P) P6.J33(HB15_P)
NetP5_J34: P5.J34(HB15_N) P6.J34(HB15_N)
NetP5_J36: P5.J36(HB18_P) P6.J36(HB18_P)
NetP5_J37: P5.J37(HB18_N) P6.J37(HB18_N)
NetP5_K4: P5.K4(CLK2_M2C_P) P6.K4(CLK2_M2C_P)
NetP5_K5: P5.K5(CLK2_M2C_N) P6.K5(CLK2_M2C_N)
NetP5_K7: P5.K7(HA02_P) P6.K7(HA02_P)
NetP5_K8: P5.K8(HA02_N) P6.K8(HA02_N)
NetP5_K10: P5.K10(HA06_P) P6.K10(HA06_P)
NetP5_K11: P5.K11(HA06_N) P6.K11(HA06_N)
NetP5_K13: P5.K13(HA10_P) P6.K13(HA10_P)
NetP5_K14: P5.K14(HA10_N) P6.K14(HA10_N)
NetP5_K16: P5.K16(HA17_P_CC) P6.K16(HA17_P_CC)
NetP5_K17: P5.K17(HA17_N_CC) P6.K17(HA17_N_CC)
NetP5_K19: P5.K19(HA21_P) P6.K19(HA21_P)
NetP5_K20: P5.K20(HA21_N) P6.K20(HA21_N)
NetP5_K22: P5.K22(HA23_P) P6.K22(HA23_P)
NetP5_K23: P5.K23(HA23_N) P6.K23(HA23_N)
NetP5_K25: P5.K25(HB00_P_CC) P6.K25(HB00_P_CC)
NetP5_K26: P5.K26(HB00_N_CC) P6.K26(HB00_N_CC)
NetP5_K28: P5.K28(HB06_P_CC) P6.K28(HB06_P_CC)
NetP5_K29: P5.K29(HB06_N_CC) P6.K29(HB06_N_CC)
NetP5_K31: P5.K31(HB10_P) P6.K31(HB10_P)
NetP5_K32: P5.K32(HB10_N) P6.K32(HB10_N)
NetP5_K34: P5.K34(HB14_P) P6.K34(HB14_P)
NetP5_K35: P5.K35(HB14_N) P6.K35(HB14_N)
NetP5_K37: P5.K37(HB17_P_CC) P6.K37(HB17_P_CC)
NetP5_K38: P5.K38(HB17_N_CC) P6.K38(HB17_N_CC)

### Notes on the sheet
- Title:
- Project:
- Date:
- Website:
- Rev:
- Engineer:
- Sheet:
- /

### Library data of the parts
P5 = MC-HPC-10: as P5 on sheet HPC_AB; PartName: ASP-134488-01; Part: ASP-134488-01; Vita PartNumber: MC-HPC-10; Pin Count: High; Gender: male; Supplier 1: Digi-Key; Supplier Part Number 1: SAM8730-ND
P6 = CC-HPC-10: as P6 on sheet HPC_AB; PartName: ASP-134486-01; Part: ASP-134486-01; Vita PartNumber: CC-HPC-10; Pin Count: High; Gender: female; Supplier 1: Digi-Key; Supplier Part Number 1: SAM8728-ND

## Nets that join several sheets
3P3V_CC: FMC_Power_Module (J2.1 P2.A1), HPC_CD (P5.C39 P5.D36 P5.D38 P5.D40)
3P3V_MC: FMC_Power_Module (6 pins), HPC_CD (P6.C39 P6.D36 P6.D38 P6.D40)
3P3VAUX_CC: FMC_Power_Module (J4.1 P4.A1), HPC_CD (P5.D32)
3P3VAUX_MC: FMC_Power_Module (J4.2 P4.A2), HPC_CD (P6.D32)
12P0V_CC: FMC_Power_Module (J1.1 P1.A1), HPC_CD (P5.C35 P5.C37)
12P0V_MC: FMC_Power_Module (J1.2 P1.A2), HPC_CD (P6.C35 P6.C37)
GND: FMC_Power_Module (7 pins), HPC_AB (80 pins), HPC_CD (66 pins), HPC_EF (58 pins), HPC_GH (56 pins), HPC_IJ (58 pins)
PG_C2M_CC: FMC_Power_Module (J8.1), HPC_CD (P5.D1)
PG_C2M_MC: FMC_Power_Module (J8.2), HPC_CD (P6.D1)
PG_M2C_CC: FMC_Power_Module (J7.2), HPC_EF (P5.F1)
PG_M2C_MC: FMC_Power_Module (J7.1), HPC_EF (P6.F1)
PRSNT_M2C_L_CC: FMC_Power_Module (J9.2), HPC_GH (P5.H2)
PRSNT_M2C_L_MC: FMC_Power_Module (J9.1), HPC_GH (P6.H2)
SCL: FMC_Power_Module (R4.1), HPC_CD (P5.C30 P6.C30)
SDA: FMC_Power_Module (R3.1), HPC_CD (P5.C31 P6.C31)
VADJ_CC: FMC_Power_Module (J3.1 P3.A1), HPC_EF (P5.E39 P5.F40), HPC_GH (P5.G39 P5.H40)
VADJ_MC: FMC_Power_Module (J3.2 P3.A2), HPC_EF (P6.E39 P6.F40), HPC_GH (P6.G39 P6.H40)
VIO_B_M2C_CC: FMC_Power_Module (J5.2), HPC_IJ (P5.J39 P5.K40)
VIO_B_M2C_MC: FMC_Power_Module (J5.1), HPC_IJ (P6.J39 P6.K40)
VREF_A_M2C_CC: FMC_Power_Module (J6.2), HPC_GH (P5.H1)
VREF_A_M2C_MC: FMC_Power_Module (J6.1), HPC_GH (P6.H1)
VREF_B_M2C_CC: FMC_Power_Module (J10.2), HPC_IJ (P5.K1)
VREF_B_M2C_MC: FMC_Power_Module (J10.1), HPC_IJ (P6.K1)